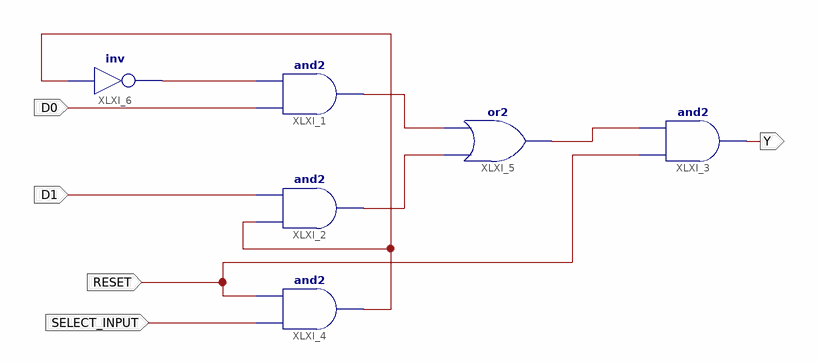
[diagram p0: schematic sheet 1]
// Xilinx ISE schematic Two_2_One_MUX.sch (artix7) as structural Verilog: 6 symbols, 5 ports
module Two_2_One_MUX (
  input  D0,
  input  D1,
  input  SELECT_INPUT,
  input  RESET,
  output Y
);

  wire XLXN_1, XLXN_2, XLXN_3, XLXN_6, XLXN_9;

  and XLXI_1 (XLXN_1, D0, XLXN_6);
  and XLXI_2 (XLXN_2, XLXN_9, D1);
  and XLXI_3 (Y, RESET, XLXN_3);
  and XLXI_4 (XLXN_9, SELECT_INPUT, RESET);
  or XLXI_5 (XLXN_3, XLXN_2, XLXN_1);
  not XLXI_6 (XLXN_6, XLXN_9);
endmodule
